# EAGLE board 1379_control (EAGLE 9.6.2)
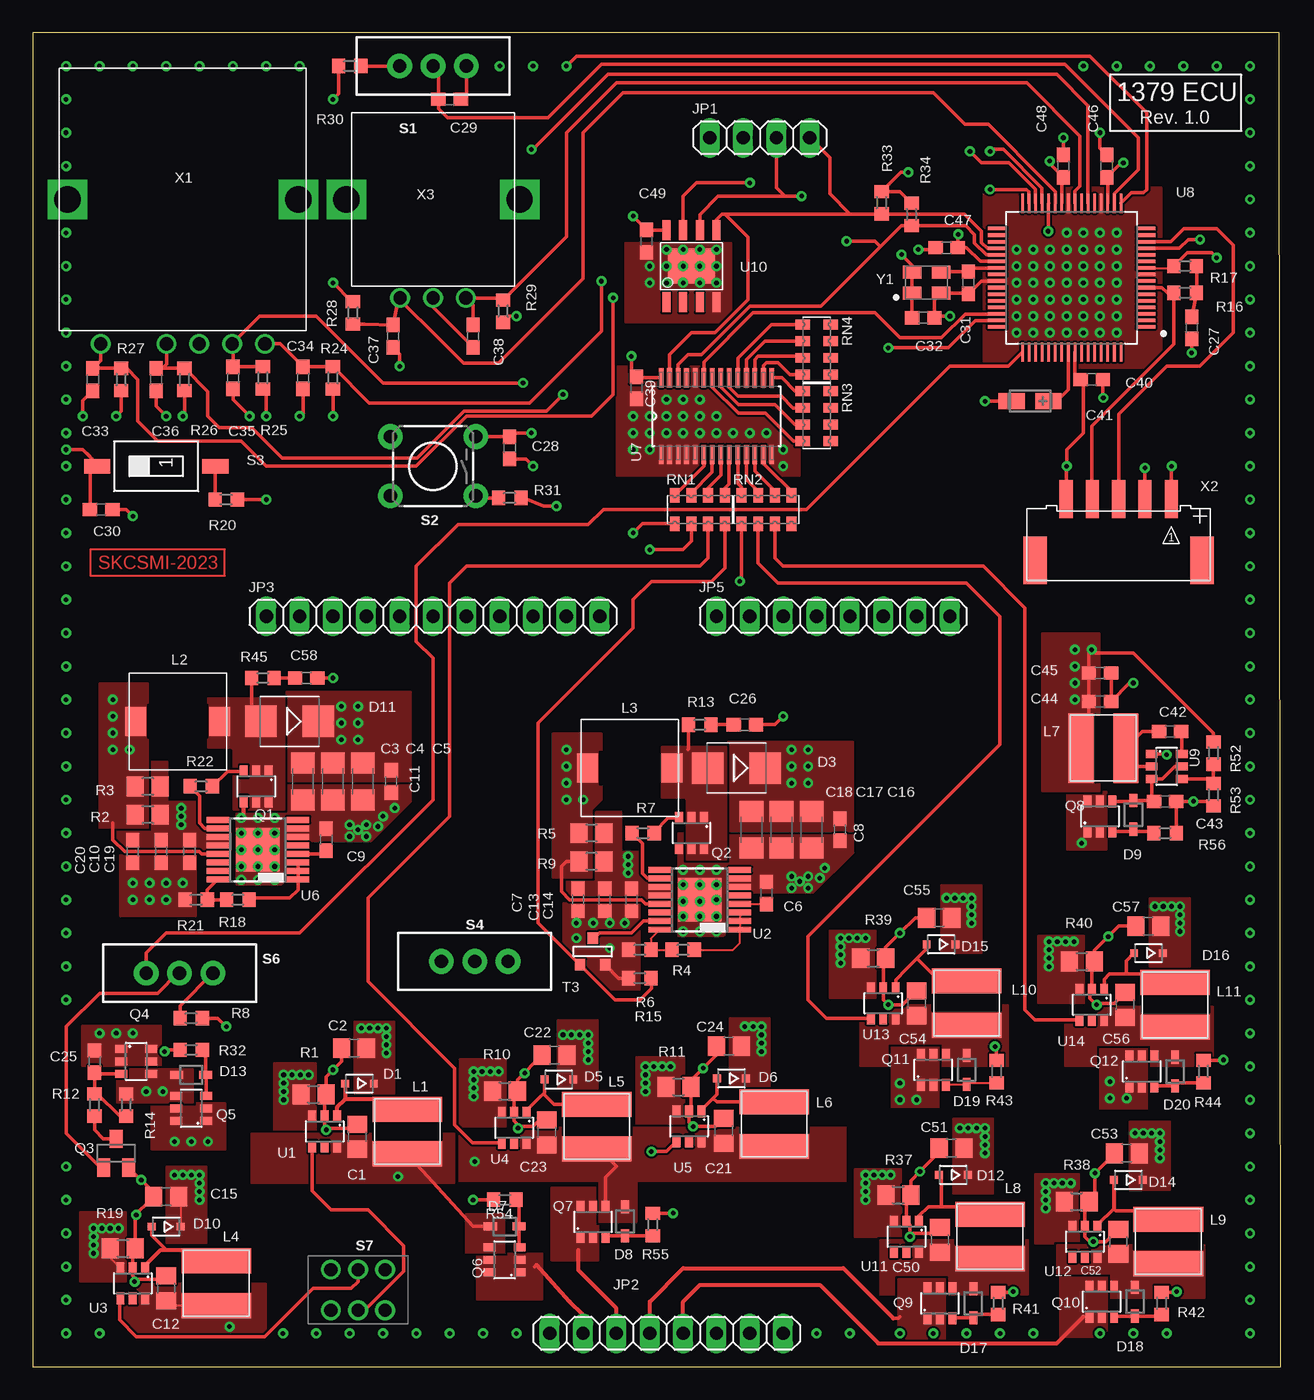
[diagram p10: board, top side]
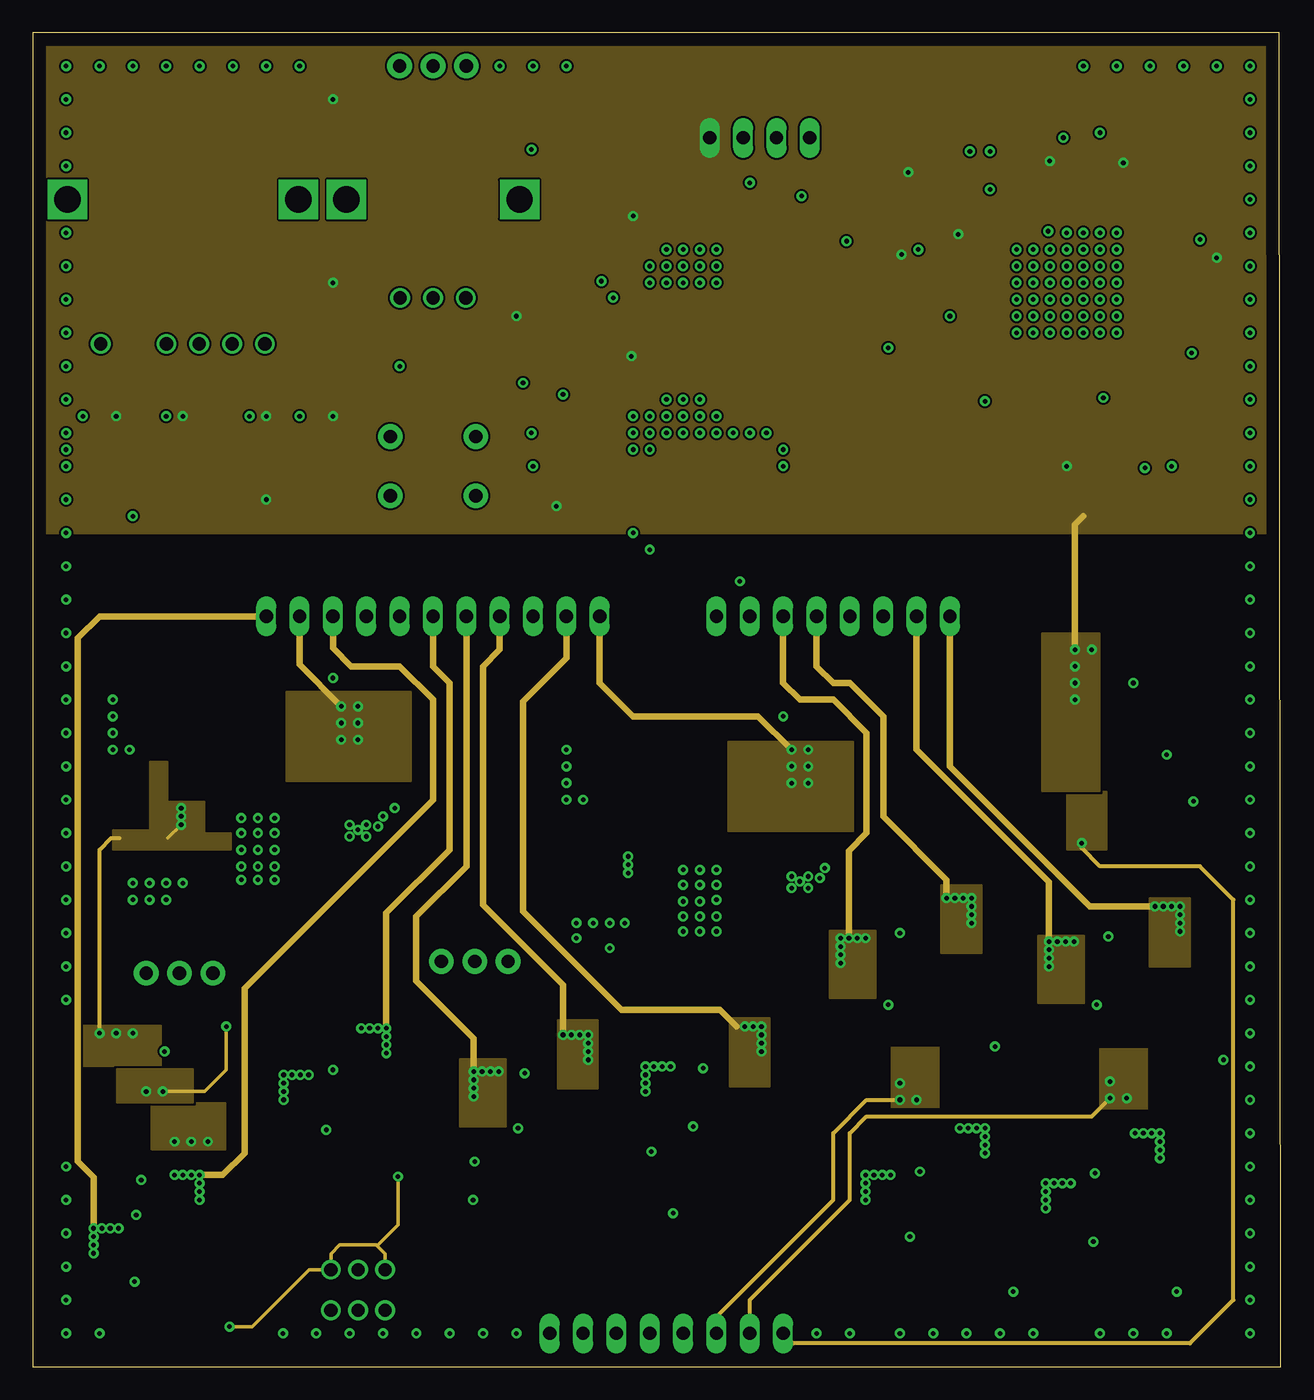
[diagram p11: board, inner layer Route2]
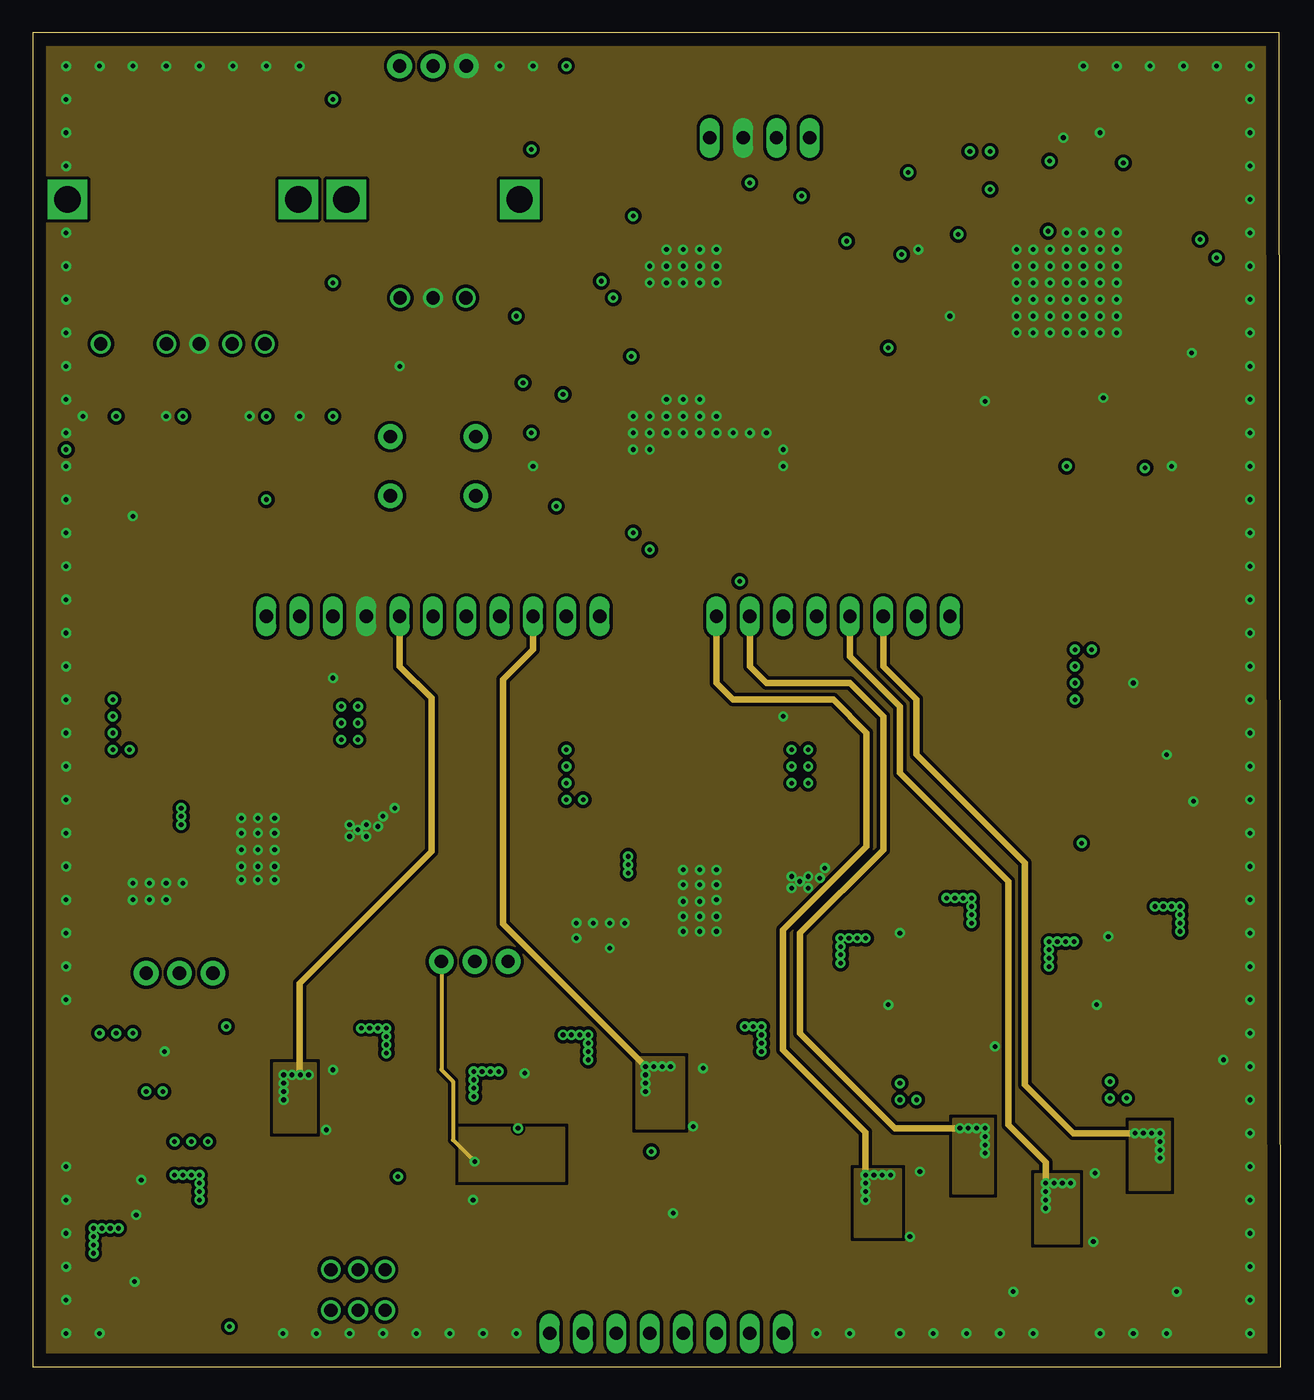
[diagram p12: board, inner layer Route15]
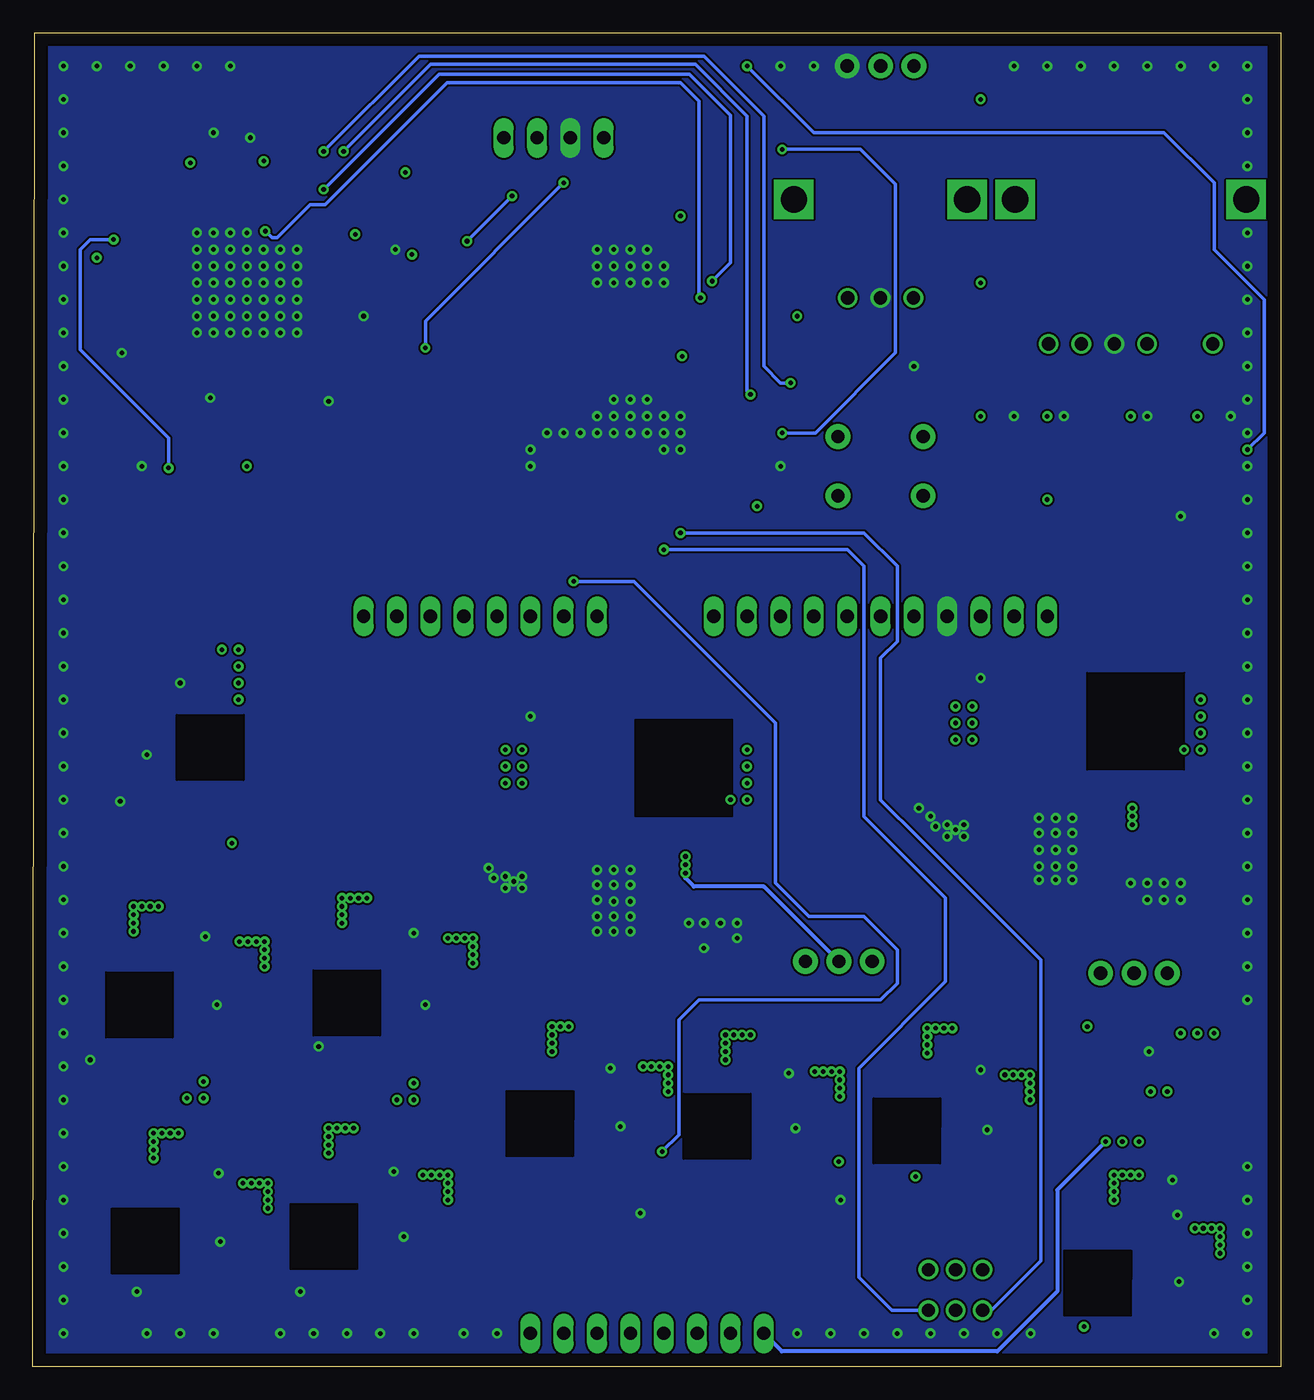
[diagram p13: board, bottom side, seen from below]

Size 95.05 x 101.59 mm. Coordinates in mm from the lower left corner, seen from the top.
Outline: 0,0 95.05,0 94.92,101.59 0,101.59 0,0
Copper layers (1+2*15+16): Top 0.035mm / dielectric 0.2mm / Route2 0.035mm / dielectric 1.065mm / Route15 0.035mm / dielectric 0.2mm / Bottom 0.035mm
Design rules "default *": minimum track width 6mil, minimum drill 0.35mm, track to track 6mil, track to pad 6mil, pad to pad 6mil, via to via 6mil, smd to smd 6mil, copper to edge 40mil, drill to drill 6mil, minimum pad ring 10mil, minimum via ring 8mil, stop-mask expansion 4mil, vias tented up to drill 0mil, thermal gap 10mil
tRestrict: 44 lines
bRestrict: 54 lines

## Footprints (pad centres in the part's own frame; a part is rotated, then mirrored left to right if it is on the bottom)
C0805 = smd 1.3 x 1.5: 1 -0.95,0; 2 0.95,0
C1206 = smd 1.6 x 1.8: 1 -1.4,0; 2 1.4,0
C0603 = smd 1.1 x 1: 1 -0.85,0; 2 0.85,0
CT3216 = smd 2 x 1.2: + -1.4,0; - 1.4,0
SOD323-R = smd 0.6 x 0.6: A 1.1,0; C -1.1,0
SMB = smd 2.4 x 2.4: A 2.2,0; C -2.2,0
SOD323 = smd 1 x 0.6: A 1.1,0; C -1.1,0
1X04 = drill 1.016 long: 1 -3.81,0; 2 -1.27,0; 3 1.27,0; 4 3.81,0
1X08 = drill 1.016 long: 1 -8.89,0; 2 -6.35,0; 3 -3.81,0; 4 -1.27,0; 5 1.27,0; 6 3.81,0; 7 6.35,0; 8 8.89,0
1X11 = drill 1.016 long: 1 -12.7,0; 2 -10.16,0; 3 -7.62,0; 4 -5.08,0; 5 -2.54,0; 6 0,0; 7 2.54,0; 8 5.08,0; 9 7.62,0; 10 10.16,0; 11 12.7,0
L_5X5 = smd 5.3 x 1.9: 1 0,-1.7; 2 0,1.7
L_7.4X7.4 = smd 2.2 x 1.6: 1 0,-3.2; 2 0,3.2
SOT23-6 = smd 0.6 x 0.9: 1 -0.95,-1.15; 2 0,-1.15; 3 0.95,-1.15; 4 0.95,1.15; 5 0,1.15; 6 -0.95,1.15
SOT23 = smd 1 x 1.4: 1 -0.95,-1.1; 2 0.95,-1.1; 3 0,1.1
R0805 = smd 1.3 x 1.5: 1 -0.95,0; 2 0.95,0
R0603 = smd 1 x 1.1: 1 -0.85,0; 2 0.85,0
EXBS8V = smd 0.75 x 1.1: 1 -1.905,-1.07; 2 -0.635,-1.07; 3 0.635,-1.07; 4 1.905,-1.07; 5 1.905,1.07; 6 0.635,1.07; 7 -0.635,1.07; 8 -1.905,1.07
SWITCH_SPDT_PTH_11.6X4.0MM = drill 1.016 pad 1.88: 1 0,2.54; 2 0,0; 3 0,-2.54
TACTILE_SWITCH_PTH_6.0MM = drill 1.016 pad 1.88: 1 -3.251,2.261; 2 3.251,2.261; 3 -3.251,-2.261; 4 3.251,-2.261
SMS-001 = smd 1.092 x 2.007: 1 0,-4.496; 2 0,4.496
SWITCH_DPDT_PTH_GPI-152-3013 = drill 1: 10 -2.06,1.55; 11 -2.06,-1.55; 20 2.06,1.55; 21 2.06,-1.55; C@1 0,1.55; C@2 0,-1.55
SOT-23 = smd 0.787 x 0.889: 1 0.025,-1.016; 2 -0.94,1.016; 3 0.991,1.016
TSSOP16E = smd 0.45 x 1.7: 1 -2.275,-3.05; 2 -1.625,-3.05; 3 -0.975,-3.05; 4 -0.325,-3.05; 5 0.325,-3.05; 6 0.975,-3.05; 7 1.625,-3.05; 8 2.275,-3.05; 9 2.275,3.05; 10 1.625,3.05; 11 0.975,3.05; 12 0.325,3.05; 13 -0.325,3.05; 14 -0.975,3.05; 15 -1.625,3.05; 16 -2.275,3.05 | smd 3.29 x 3.29: EXP 0,0
SOP65P640X110-28N = smd 1.473 x 0.356: 1 -2.921,4.216; 2 -2.921,3.581; 3 -2.921,2.921; 4 -2.921,2.286; 5 -2.921,1.626; 6 -2.921,0.965; 7 -2.921,0.33; 8 -2.921,-0.33; 9 -2.921,-0.965; 10 -2.921,-1.626; 11 -2.921,-2.286; 12 -2.921,-2.921; 13 -2.921,-3.581; 14 -2.921,-4.216; 15 2.921,-4.216; 16 2.921,-3.581; 17 2.921,-2.921; 18 2.921,-2.286; 19 2.921,-1.626; 20 2.921,-0.965; 21 2.921,-0.33; 22 2.921,0.33; 23 2.921,0.965; 24 2.921,1.626; 25 2.921,2.286; 26 2.921,2.921; 27 2.921,3.581; 28 2.921,4.216
PIC32MX-TQFN = smd 1.47 x 0.28: 1 -5.67,3.75; 2 -5.67,3.25; 3 -5.67,2.75; 4 -5.67,2.25; 5 -5.67,1.75; 6 -5.67,1.25; 7 -5.67,0.75; 8 -5.67,0.25; 9 -5.67,-0.25; 10 -5.67,-0.75; 11 -5.67,-1.25; 12 -5.67,-1.75; 13 -5.67,-2.25; 14 -5.67,-2.75; 15 -5.67,-3.25; 16 -5.67,-3.75; 33 5.67,-3.75; 34 5.67,-3.25; 35 5.67,-2.75; 36 5.67,-2.25; 37 5.67,-1.75; 38 5.67,-1.25; 39 5.67,-0.75; 40 5.67,-0.25; 41 5.67,0.25; 42 5.67,0.75; 43 5.67,1.25; 44 5.67,1.75; 45 5.67,2.25; 46 5.67,2.75; 47 5.67,3.25; 48 5.67,3.75 | smd 0.28 x 1.47: 17 -3.75,-5.67; 18 -3.25,-5.67; 19 -2.75,-5.67; 20 -2.25,-5.67; 21 -1.75,-5.67; 22 -1.25,-5.67; 23 -0.75,-5.67; 24 -0.25,-5.67; 25 0.25,-5.67; 26 0.75,-5.677; 27 1.25,-5.67; 28 1.75,-5.67; 29 2.25,-5.67; 30 2.75,-5.67; 31 3.25,-5.67; 32 3.75,-5.67; 49 3.75,5.67; 50 3.25,5.67; 51 2.75,5.67; 52 2.25,5.67; 53 1.75,5.67; 54 1.25,5.67; 55 0.75,5.67; 56 0.25,5.67; 57 -0.25,5.67; 58 -0.75,5.67; 59 -1.25,5.67; 60 -1.75,5.67; 61 -2.25,5.67; 62 -2.75,5.67; 63 -3.25,5.67; 64 -3.75,5.67
SO-8 = smd 1.524 x 0.61: 1 -2.743,1.905; 2 -2.743,0.635; 3 -2.743,-0.635; 4 -2.743,-1.905; 5 2.743,-1.905; 6 2.743,-0.635; 7 2.743,0.635; 8 2.743,1.905 | smd 2.7 x 3.6: EP 0,0
ENCODER = drill 1: P$1 -6.25,-11; P$2 -1.25,-11; P$3 1.25,-11; P$4 3.75,-11; P$5 6.25,-11 | drill 2 square: P$6 -8.8,0; P$7 8.8,0
BM05B-PASS = smd 1.8 x 3.6: A 0.15,-3.35; B -12.55,-3.35 | smd 1 x 2.9: P$1 -2.2,1.3; P$2 -4.2,1.3; P$3 -6.2,1.3; P$4 -8.2,1.3; P$5 -10.2,1.3
ENCODER-2 = drill 1: P$1 -2.5,-7.5; P$2 0,-7.5; P$3 2.5,-7.5 | drill 2 square: P$6 -6.6,0; P$7 6.6,0
WE-SPXO_CFPS-104 = smd 1.4 x 1: 1 -1.1,-0.8; 2 1.1,-0.8; 3 1.1,0.8; 4 -1.1,0.8

## Placement (x,y rotation side)
C1  10u  [C0805]  24.71,17.52 90 top
C2  1u  [C0805]  24.45,24.25 180 top
C3  1u  [C1206]  20.57,44.58 90 top
C4  1u  [C1206]  22.86,44.58 90 top
C5  1u  [C1206]  25.15,44.58 90 top
C6  100p  [C0603]  55.88,36.07 270 top
C7  4u7  [C0603]  41.53,35.56 90 top
C8  4u7  [C0603]  61.47,40.89 90 top
C9  100p  [C0603]  22.35,40.13 270 top
C10  4u7  [C0603]  9.78,39.24 90 top
C11  4u7  [C0603]  27.3,44.58 90 top
C12  10u  [C0805]  10.16,5.97 90 top
C13  1u  [C0603]  43.56,35.56 90 top
C14  100n  [C0603]  45.59,35.56 90 top
C15  1u  [C0805]  10.16,12.95 180 top
C16  1u  [C1206]  59.31,40.89 90 top
C17  1u  [C1206]  57.02,40.89 90 top
C18  1u  [C1206]  54.74,40.89 90 top
C19  100n  [C0603]  11.94,39.24 90 top
C20  1u  [C0603]  7.62,39.24 90 top
C21  10u  [C0805]  52.62,17.95 90 top
C22  1u  [C0805]  39.74,23.73 180 top
C23  10u  [C0805]  39.14,17.84 90 top
C24  1u  [C0805]  53.02,24.41 180 top
C25  100n  [C0603]  4.7,23.24 270 top
C26  10p  [C0603]  54.23,48.89 180 top
C27  100nF  [C0603]  88.27,79.12 270 top
C28  100nF  [C0603]  36.32,69.98 270 top
C29  100nF  [C0603]  31.75,96.52 0 top
C30  100nF  [C0603]  5.21,65.28 0 top
C31  15pF  [C0603]  71.25,82.55 270 top
C32  100nF  [C0603]  67.82,79.88 0 top
C33  100nF  [C0603]  4.57,75.18 270 top
C34  100nF  [C0603]  20.57,75.31 270 top
C35  100nF  [C0603]  15.24,75.31 270 top
C36  100nF  [C0603]  9.4,75.18 270 top
C37  100nF  [C0603]  27.43,78.49 270 top
C38  100nF  [C0603]  33.53,78.49 270 top
C39  100nF  [C0603]  45.97,74.55 270 top
C40  100nF  [C0603]  80.64,75.18 0 top
C41  10uF/6.3V  [CT3216]  75.95,73.53 180 top
C42  100nF  [C0603]  86.61,48.39 180 top
C43  100nF  [C0603]  86.23,43.05 180 top
C44  22u  [C0603]  81.28,50.67 180 top
C45  22u  [C0603]  81.28,52.83 180 top
C46  100nF  [C0603]  81.79,91.44 90 top
C47  100nF  [C0603]  69.6,85.22 180 top
C48  100nF  [C0603]  78.49,91.44 90 top
C49  100nF  [C0603]  46.74,85.73 270 top
C50  10u  [C0805]  69.09,9.65 90 top
C51  1u  [C0805]  69.98,16.64 180 top
C52  10u  [C0805]  82.68,9.53 90 top
C53  1u  [C0805]  83.31,16.26 180 top
C54  10u  [C0805]  67.31,27.69 90 top
C55  1u  [C0805]  69.03,34.19 180 top
C56  10u  [C0805]  83.19,27.56 90 top
C57  1u  [C0805]  84.95,33.55 180 top
C58  10p  [C0603]  20.83,52.45 180 top
D1  PMEG6002EJ115  [SOD323-R]  24.88,21.56 180 top
D3  B2100  [SMB]  53.59,45.59 180 top
D5  PMEG6002EJ115  [SOD323-R]  40.06,21.87 180 top
D6  PMEG6002EJ115  [SOD323-R]  53.21,21.96 180 top
D7  BZX84J  [SOD323]  35.95,10.68 0 top
D8  BZX84J  [SOD323]  45.11,11.08 270 top
D9  BZX84J  [SOD323]  83.82,42.04 270 top
D10  PMEG6002EJ115  [SOD323-R]  10.16,10.67 180 top
D11  B2100  [SMB]  19.56,49.15 180 top
D12  PMEG6002EJ115  [SOD323-R]  70.1,14.61 180 top
D13  BZX84J  [SOD323]  12.07,22.23 0 top
D14  PMEG6002EJ115  [SOD323-R]  83.44,14.22 180 top
D15  PMEG6002EJ115  [SOD323-R]  69.18,32.17 180 top
D16  PMEG6002EJ115  [SOD323-R]  84.97,31.5 180 top
D17  BZX84J  [SOD323]  71.63,4.83 270 top
D18  BZX84J  [SOD323]  83.95,4.95 270 top
D19  BZX84J  [SOD323]  71.12,22.61 270 top
D20  BZX84J  [SOD323]  87,22.48 270 top
JP1  [1X04]  55.37,93.6 0 top
JP2  [1X08]  48.26,2.54 0 top
JP3  [1X11]  30.48,57.15 0 top
JP5  [1X08]  60.96,57.15 0 top
L1  SRR4828A-101M  [L_5X5]  28.52,17.9 0 top
L2  7447773101  [L_7.4X7.4]  11.05,49.15 270 top
L3  470u  [L_7.4X7.4]  45.47,45.59 270 top
L4  SRR4828A-101M  [L_5X5]  13.97,6.35 0 top
L5  SRR4828A-101M  [L_5X5]  42.95,18.28 0 top
L6  SRR4828A-101M  [L_5X5]  56.48,18.46 0 top
L7  LPS5030-103MRC  [L_5X5]  81.53,47.12 90 top
L8  SRR4828A-101M  [L_5X5]  72.9,9.91 0 top
L9  SRR4828A-101M  [L_5X5]  86.49,9.53 0 top
L10  SRR4828A-101M  [L_5X5]  71.12,27.69 0 top
L11  SRR4828A-101M  [L_5X5]  87,27.56 0 top
Q1  ZXMN6A08E6  [SOT23-6]  17.02,44.2 180 top
Q2  ZXMN6A08E6  [SOT23-6]  50.16,40.64 180 top
Q3  IRLML0100TR  [SOT23]  6.35,16.26 0 top
Q4  ZXMP3A17E6  [SOT23-6]  7.87,23.24 270 top
Q5  ZXMP3A17E6  [SOT23-6]  12.07,19.68 90 top
Q6  ZXMP3A17E6  [SOT23-6]  35.95,8.14 90 top
Q7  ZXMP3A17E6  [SOT23-6]  42.67,11.03 0 top
Q8  ZXMP3A17E6  [SOT23-6]  81.28,41.91 0 top
Q9  ZXMP3A17E6  [SOT23-6]  69.09,4.83 0 top
Q10  ZXMP3A17E6  [SOT23-6]  81.41,4.95 0 top
Q11  ZXMP3A17E6  [SOT23-6]  68.58,22.61 0 top
Q12  ZXMP3A17E6  [SOT23-6]  84.45,22.48 0 top
R1  1R3  [R0805]  21.38,20.75 0 top
R2  0R56  [R0805]  8.76,42.04 180 top
R3  0R56  [R0805]  8.76,44.2 180 top
R4  68k  [R0603]  49.53,31.75 180 top
R5  2R2  [R0805]  42.55,40.64 180 top
R6  22k  [R0603]  46.23,31.75 180 top
R7  2R2  [R0603]  46.48,40.64 0 top
R8  10k  [R0603]  12.07,26.54 0 top
R9  2R2  [R0805]  42.55,38.48 180 top
R10  4R  [R0805]  35.95,20.99 0 top
R11  4R  [R0805]  49.17,21.32 0 top
R12  0R  [R0603]  4.7,19.94 90 top
R13  1k  [R0603]  50.8,48.89 180 top
R14  10k  [R0603]  7.11,19.94 90 top
R15  10k  [R0603]  46.23,29.59 0 top
R16  1k  [R0603]  87.76,81.79 180 top
R17  10k  [R0603]  87.76,83.82 0 top
R18  110k  [R0603]  15.62,35.56 180 top
R19  1R3  [R0805]  6.86,9.02 0 top
R20  10k  [R0603]  14.73,66.04 180 top
R21  39k  [R0603]  12.45,35.56 180 top
R22  2R2  [R0603]  12.83,44.2 0 top
R24  10k  [R0603]  22.86,75.31 90 top
R25  10k  [R0603]  17.53,75.31 90 top
R26  10k  [R0603]  11.56,75.18 90 top
R27  10k  [R0603]  6.73,75.18 90 top
R28  10k  [R0603]  24.38,80.26 270 top
R29  10k  [R0603]  35.81,80.39 90 top
R30  10k  [R0603]  24.13,99.06 0 top
R31  10k  [R0603]  36.32,66.17 180 top
R32  10k  [R0603]  12.07,24.13 180 top
R33  4k7  [R0603]  64.64,88.65 270 top
R34  4k7  [R0603]  66.93,87.76 270 top
R37  1R05  [R0805]  65.91,13.08 0 top
R38  1R43  [R0805]  79.5,12.57 0 top
R39  6R6  [R0805]  64,31.12 0 top
R40  2R2  [R0805]  79.91,30.86 0 top
R41  10k  [R0603]  73.53,4.83 90 top
R42  10k  [R0603]  85.98,4.83 90 top
R43  10k  [R0603]  73.41,22.48 90 top
R44  10k  [R0603]  89.15,22.48 90 top
R45  1k  [R0603]  17.53,52.45 180 top
R52  100k  [R0603]  89.92,46.74 270 top
R53  22k1  [R0603]  89.92,43.56 270 top
R54  10k  [R0603]  35.95,12.71 180 top
R55  10k  [R0603]  47.21,10.83 90 top
R56  10k  [R0603]  86.23,40.64 0 top
RN1  [EXBS8V]  50.8,65.28 0 top
RN2  [EXBS8V]  55.88,65.28 0 top
RN3  [EXBS8V]  59.69,72.39 270 top
RN4  [EXBS8V]  59.69,77.47 270 top
S1  [SWITCH_SPDT_PTH_11.6X4.0MM]  30.48,99.06 90 top
S2  MOMENTARY-SWITCH-SPST-PTH-6.0MM  [TACTILE_SWITCH_PTH_6.0MM]  30.48,68.58 180 top
S3  SWS001  [SMS-001]  9.4,68.58 90 top
S4  [SWITCH_SPDT_PTH_11.6X4.0MM]  33.66,30.86 270 top
S6  [SWITCH_SPDT_PTH_11.6X4.0MM]  11.18,29.97 90 top
S7  DPDT  [SWITCH_DPDT_PTH_GPI-152-3013]  24.77,5.84 0 top
T3  2N7002A  [SOT-23]  42.67,31.62 180 top
U1  AP3031  [SOT23-6]  22.23,17.91 180 top
U2  ZXLD1370Q  [TSSOP16E]  50.8,35.56 90 top
U3  AP3031  [SOT23-6]  7.62,6.35 180 top
U4  AP3031  [SOT23-6]  36.67,18.2 180 top
U5  AP3031  [SOT23-6]  49.99,18.31 180 top
U6  ZXLD1370Q  [TSSOP16E]  17.14,39.37 90 top
U7  PCA9685PW,118  [SOP65P640X110-28N]  52.07,72.39 90 top
U8  PIC32MX120F064H  [PIC32MX-TQFN]  79.12,82.93 180 top
U9  LMR51420  [SOT23-6]  86.36,45.72 270 top
U10  ST-M24256E-FMN6TP  [SO-8]  50.16,83.82 90 top
U11  AP3031  [SOT23-6]  66.55,9.91 180 top
U12  AP3031  [SOT23-6]  80.14,9.53 180 top
U13  AP3031  [SOT23-6]  64.77,27.69 180 top
U14  AP3031  [SOT23-6]  80.64,27.56 180 top
X1  ENODER_ROTARY  [ENCODER]  11.43,88.9 0 top
X2  BM05B-PASS  [BM05B-PASS]  88.9,64.77 0 top
X3  ENCODER-2  [ENCODER-2]  30.48,88.9 0 top
Y1  MCSJK-3N-8.00-3.3-25-B  [WE-SPXO_CFPS-104]  68.07,82.55 0 top

## Tracks (layer width: path | path; a pad name or v marks a point on that pad's centre or on a via)
3,3V  (via drill 0.35)
  Top 0.152: U8.10 86.77,83.68 R17.1
  Top 0.254: U8.57 79.37,75.61 C40.1 80.01,74.97 80.01,72.39 80.01,71.12 78.74,69.85 v78.74,68.58 78.7,68.54 X2.P$5 | R17.1 87.92,84.84 89.79,84.84 v90.17,84.45 | U8.38 72.16,84.18 71.12,85.22 C47.1 | U8.19 81.87,90.51 C46.1 82.89,91.69 v83.06,91.69 | U8.26 78.37,90.49 78.36,90.5 78.4,90.5 C48.1 77.47,91.61 v77.47,91.82 v77.45,91.82 | U7.28 46.06,75.31 C39.1 45.59,75.78 v45.59,76.96 | R34.1 66.04,89.5 R33.1 66.11,90.96 v66.67,90.96 | L7.2 80.43,47.71 C44.2 C45.2 80.43,54.39 v80.64,54.61 80.9,54.36 83.82,54.36 89.92,48.26 R52.1 | C49.1 48.25,86.58 U10.8 | C49.1 46.99,86.83 | C32.1 Y1.1 Y1.4 66.97,83.9 v66.17,84.71 | C47.1 70.45,86.36 | C47.1 70.45,86.21 v70.48,86.25 | C49.1 46.74,86.61 v45.72,87.63 | R31.1 37.41,66.17 38.9,65.53 v39.88,65.53 | v17.78,66.04 R20.1 | R30.1 23.28,96.94 v22.86,96.52 | R27.1 6.73,72.77 v6.35,72.39 | R26.1 11.56,72.52 v11.43,72.39 | R25.1 17.78,74.21 v17.78,72.39 | R24.1 v22.86,72.39 | R28.1 24.3,81.11 v22.86,82.55 | R29.1 36.28,80.01 v36.83,80.01
  Route2 0.254: 66.67,91 66.64,91.03 66.64,91 v66.67,90.96 66.67,90.9 66.71,90.9
  Route2 0.508: v79.38,54.61 79.38,64.14 80.01,64.77
  other vias: 79.38,53.34 79.38,52.07 79.38,50.8
  pour Top (no thermals): 81.28,55.88 81.28,43.81 76.83,43.81 76.83,55.88
  pour Route2 (no thermals): 81.28,55.88 81.28,43.81 76.83,43.81 76.83,55.88
  pour Route2 (no thermals): -2.54,102.87 -2.54,63.5 96.52,63.5 96.52,102.87
!MCLR
  Top 0.254: U8.7 86.01,82.18 86.4,81.79 R16.2 86.91,77.89 80.64,71.63 80.64,66.12 X2.P$4
!WC  (via drill 0.35)
  Top 0.254: U10.7 49.53,89.15 50.55,90.17 v54.61,90.17 | U8.47 71.81,79.68 69.72,77.6 v65.15,77.6
  Bottom 0.254: v65.15,77.6 65.15,79.63 v54.61,90.17
CHMSL  (via drill 0.35)
  Route2 0.305: JP2.7 54.61,5.08 62.23,12.7 62.23,17.78 63.5,19.05 80.64,19.05 v82.04,20.45
  other vias: 83.31,20.45 82.04,21.72
  pour Top (no thermals): 84.85,24.21 84.85,19.62 81.3,19.62 81.3,24.21
  pour Route2 (no thermals): 84.85,24.21 84.85,19.62 81.3,19.62 81.3,24.21
CHMSL_A  (via drill 0.35)
  Route2 0.508: JP5.8 69.85,45.72 80.52,35.05 v85.47,35.05
  other vias: 86.11,35.05 86.74,35.05 87.38,34.42 87.38,33.78 87.38,33.15 87.38,35.05
  pour Top (rank 3, no thermals): 85.05,35.69 85.05,30.44 88.15,30.44 88.15,35.69
  pour Route2 (rank 3, no thermals): 85.05,35.69 85.05,30.44 88.15,30.44 88.15,35.69
CHMSL_K  (via drill 0.35)
  Route2 0.508: v77.4,31.75 77.4,36.9 67.31,46.99 JP5.7
  other vias: 78.03,32.38 78.67,32.38 79.3,32.38 77.4,32.38 77.4,31.11 77.4,30.48
  pour Top (rank 3, no thermals): 76.55,27.65 80.11,27.65 80.11,32.86 76.55,32.86
  pour Route2 (rank 3, no thermals): 76.55,27.65 80.11,27.65 80.11,32.86 76.55,32.86
CLOCK
  Top 0.254: U8.39 71.53,83.68 C31.1 69.22,83.4 Y1.3
CTRL1
  Top 0.254: U3.4 6.6,5.13 6.6,3.56 7.87,2.29 17.65,2.29 21.34,5.97 24.26,5.97 24.77,6.48 S7.C@1
CTRL2
  Top 0.254: S7.C@2 25.27,4.29 28.24,7.26 28.24,9.22 25.53,11.94 22.73,11.94 21.28,13.39 U1.4
FOG
  Top 0.254: 65.53,3.68 65.91,3.68 66.04,3.81
  Top 0.305: JP2.4 46.99,4.95 49.53,7.49 61.72,7.49 65.53,3.68
  pour Top (no thermals): 69.48,6.68 69.48,2.1 65.93,2.1 65.93,6.68
FOG_A  (via drill 0.35)
  Route15 0.508: JP5.2 54.61,53.34 55.88,52.07 62.23,52.07 64.77,49.53 64.77,39.37 58.42,33.02 58.42,25.4 65.66,18.16 v70.61,18.16
  other vias: 71.25,18.16 71.88,18.16 72.52,17.53 72.52,16.89 72.52,16.26 72.52,18.16
  pour Top (rank 3, no thermals): 70.06,18.93 70.06,13.17 73.16,13.17 73.16,18.93
  pour Route15 (rank 2, no thermals): 70.06,18.93 70.06,13.17 73.16,13.17 73.16,18.93
FOG_K  (via drill 0.35)
  Route15 0.508: v63.43,13.97 63.43,17.85 57.15,24.13 57.15,33.27 63.5,39.62 63.5,48.26 60.96,50.8 53.34,50.8 52.07,52.07 JP5.1
  other vias: 64.06,14.6 64.7,14.6 65.33,14.6 63.43,14.6 63.43,13.33 63.43,12.7
  pour Top (rank 3, no thermals): 62.59,9.87 66.14,9.87 66.14,15.08 62.59,15.08
  pour Route15 (rank 2, no thermals): 62.59,9.87 66.14,9.87 66.14,15.08 62.59,15.08
FREQ/DUTY
  Top 0.254: S1.2 30.9,98.64 C29.1 30.9,95.81 31.59,95.12 39.24,95.12 43.31,99.19 78.61,99.19 84.2,93.6 84.2,91.18 82.37,89.35 U8.18
GND  (via drill 0.35)
  Top 0.152: C32.2 68.67,80.01 | C47.2 68.62,85.09
  Top 0.254: C12.2 9.88,6.64 7.91,6.64 | 7.91,6.64 7.62,6.93 U3.2 7.62,8.83 R19.2 7.81,11.55 8.92,12.67 | 8.92,12.67 C15.2 | C1.2 24.4,18.16 22.48,18.16 22.35,18.29 | 22.35,18.29 22.23,18.41 U1.2 22.23,20.65 R1.2 22.33,22.07 23.51,23.25 C2.2 | C23.2 38.61,18.8 38.1,18.29 37.08,18.29 | 37.08,18.29 36.67,18.71 U4.2 36.67,20.76 R10.2 36.9,21.85 C22.2 | Q3.2 8.92,13.53 8.92,12.67 | v7.75,6.48 7.91,6.64 | v10.03,24 10.16,24.13 R32.2 | v22.35,18.03 22.35,18.29 | R54.2 33.54,12.71 v33.53,12.7 | v36.96,18.16 37.08,18.29 | R55.2 v48.76,11.68 v48.77,11.68 | C24.2 52.07,23.75 v51.05,22.73 50.12,21.8 R11.2 50.12,19.59 U5.2 49.99,18.59 v50.29,18.29 52.01,18.29 C21.2 | R15.1 44.63,29.59 T3.2 | C58.1 v22.86,52.45 22.99,52.45 | C50.2 68.65,10.16 67.06,10.16 v66.8,9.91 66.8,10.8 U11.2 66.55,12.77 R37.2 66.86,14.16 v67.56,14.86 69.03,16.32 C51.2 | R42.2 87.08,5.68 v87.12,5.71 | R41.2 74.64,5.68 v74.68,5.71 | C52.2 81.73,9.53 v80.77,9.53 80.52,9.53 80.14,9.91 U12.2 80.14,12.26 R38.2 80.9,13.02 v80.9,14.73 82.36,16.2 C53.2 | R43.2 73.41,24.26 v73.28,24.38 | R44.2 90.64,23.33 v90.68,23.37 | C57.2 82.7,33.55 v81.91,32.77 80.86,31.71 R40.2 80.64,30.65 U14.2 80.52,28.58 80.52,28.07 v81.03,27.56 81.15,27.69 82.36,27.69 C56.2 | C55.2 67.21,34.19 v66.04,33.02 64.95,31.93 R39.2 64.77,30.93 U13.2 64.77,27.94 v65.15,27.56 66.23,27.56 C54.2 | U9.1 86.3,46.67 v86.36,46.61 | C45.1 C44.1 83.53,52.07 v83.82,52.07 | R53.2 89.57,43.05 v88.39,43.05 C43.1 R56.2 | X2.P$1 86.7,68.54 v86.74,68.58 | v81.28,93.98 81.28,92.8 C46.2 | C48.2 v78.49,93.6 78.49,93.73 | C27.2 v88.27,77.22 88.27,77.09 | C40.2 81.5,73.83 v81.53,73.79 | C41.- v72.52,73.53
  Top 0.254: 4.45,74.21 C33.2 3.81,73.57 v3.81,72.39 | U8.41 72.23,82.68 C31.2 71.2,81.75 Y1.2 68.67,81.25 68.67,80.01 v69.85,80.01 | 68.62,85.09 v67.44,85.09 67.31,85.09 | 15.09,74.31 C35.2 15.24,73.66 v16.51,72.39 | C28.2 37.55,69.13 v38.1,68.58 | S1.3 33.02,96.94 C29.2 | C26.1 56.52,48.89 v57.15,49.53 | C36.2 9.4,73.15 v10.16,72.39 | C34.2 20.57,72.64 v20.32,72.39 | C37.2 27.94,77.13 v27.94,76.2 | C38.2 30.48,80.68 X3.P$2 | C30.2 7.11,65.28 v7.62,64.77
  Top 0.305: v15.88,41.78 16,41.91 16,42.98 Q1.4
  other vias: 17.14,39.37 15.88,40.64 17.14,40.64 18.41,40.64 18.41,39.37 15.88,39.37 17.14,38.1 18.41,38.1 15.88,38.1 52.07,35.56 49.53,34.29 50.8,34.29 52.07,34.29 7.62,36.83 8.89,36.83 10.16,36.83 11.43,36.83 24.13,41.27 25.4,41.27 26.67,41.91 24.13,40.39 25.4,40.39 27.56,42.54 26.29,41.15 24.77,40.89 17.14,41.78 18.41,41.78 15.88,37.08 17.14,37.08 18.41,37.08 10.16,35.56 8.89,35.56 7.62,35.56 41.4,33.78 42.67,33.78 43.94,33.78 45.09,33.78 43.94,31.88 41.4,32.64 50.8,35.43 49.53,36.7 50.8,36.7 52.07,36.7 49.53,35.43 49.53,37.85 57.78,37.34 59.05,37.34 60.32,37.97 57.78,36.45 59.05,36.45 59.94,37.21 58.42,36.96 50.8,37.85 52.07,37.85 49.53,33.15 50.8,33.15 52.07,33.15 7.87,11.56 8.25,14.22 22.86,22.61 37.46,22.35 49.53,83.82 50.8,83.82 52.07,83.82 52.07,82.55 50.8,82.55 49.53,82.55 48.26,82.55 48.26,83.82 48.26,85.09 49.53,85.09 50.8,85.09 52.07,85.09 46.99,83.82 46.99,82.55 74.93,82.55 76.2,82.55 77.47,82.55 78.74,82.55 80.01,82.55 81.28,82.55 82.55,82.55 74.93,85.09 76.2,85.09 77.47,85.09 78.74,85.09 80.01,85.09 81.28,85.09 82.55,85.09 78.74,86.36 80.01,86.36 81.28,86.36 82.55,86.36 74.93,83.82 76.2,83.82 77.47,83.82 78.74,83.82 80.01,83.82 81.28,83.82 82.55,83.82 74.93,81.28 76.2,81.28 77.47,81.28 78.74,81.28 80.01,81.28 81.28,81.28 82.55,81.28 74.93,80.01 76.2,80.01 77.47,80.01 78.74,80.01 80.01,80.01 81.28,80.01 82.55,80.01 74.93,78.74 76.2,78.74 77.47,78.74 78.74,78.74 80.01,78.74 81.28,78.74 82.55,78.74 48.26,73.66 49.53,73.66 49.53,72.39 49.53,71.12 48.26,71.12 48.26,72.39 46.99,72.39 46.99,71.12 45.72,72.39 45.72,71.12 46.99,69.85 45.72,69.85 50.8,71.12 52.07,71.12 53.34,71.12 54.61,71.12 55.88,71.12 57.15,69.85 57.15,68.58 50.8,72.39 52.07,72.39 50.8,73.66 92.71,2.54 92.71,5.08 92.71,7.62 92.71,10.16 92.71,12.7 92.71,15.24 92.71,17.78 92.71,20.32 92.71,22.86 92.71,25.4 92.71,27.94 92.71,30.48 92.71,33.02 92.71,35.56 92.71,38.1 92.71,40.64 92.71,43.18 92.71,45.72 92.71,48.26 92.71,50.8 92.71,53.34 92.71,55.88 92.71,58.42 92.71,60.96 92.71,63.5 92.71,66.04 92.71,68.58 92.71,71.12 92.71,73.66 92.71,76.2 92.71,78.74 92.71,81.28 92.71,83.82 92.71,86.36 92.71,88.9 92.71,91.44 92.71,93.98 92.71,96.52 92.71,99.06 90.17,99.06 87.63,99.06 85.09,99.06 82.55,99.06 80.01,99.06 20.32,99.06 17.78,99.06 15.24,99.06 35.56,99.06 38.1,99.06 12.7,99.06 10.16,99.06 7.62,99.06 5.08,99.06 2.54,99.06 2.54,86.36 2.54,91.44 2.54,93.98 2.54,96.52 2.54,73.66 2.54,76.2 2.54,78.74 2.54,81.28 2.54,83.82 2.54,60.96 2.54,63.5 2.54,66.04 2.54,68.58 2.54,71.12 2.54,48.26 2.54,50.8 2.54,53.34 2.54,55.88 2.54,58.42 2.54,35.56 2.54,38.1 2.54,40.64 2.54,43.18 2.54,45.72 2.54,27.94 2.54,30.48 2.54,33.02 2.54,10.16 2.54,12.7 2.54,15.24 2.54,2.54 2.54,5.08 2.54,7.62 5.08,2.54 29.21,2.54 26.67,2.54 24.13,2.54 21.59,2.54 19.05,2.54 36.83,2.54 34.29,2.54 31.75,2.54 81.28,2.54 86.36,2.54 83.82,2.54 68.58,2.54 66.04,2.54 76.2,2.54 73.66,2.54 71.12,2.54 59.69,2.54 62.23,2.54
  pour Route15 (isolate 0.254, rank 4, no thermals): -3.81,105.41 -3.81,-2.54 96.52,-2.54 100.33,1.27 100.33,104.14 99.06,105.41
  pour Top (rank 3, no thermals): 15.49,44.58 15.49,36.7 18.92,36.7 19.05,36.83 19.05,40 25.78,40 28.83,43.05 28.83,44.58
  pour Top (rank 3, no thermals): 12.45,38.99 6.6,38.99 6.6,34.29 12.45,34.29
  pour Top (rank 3, no thermals): 46.23,35.31 40.39,35.31 40.39,28.7 46.23,28.7
  pour Top (rank 3, no thermals): 49.15,40.64 49.15,32.77 52.58,32.77 52.7,32.89 52.7,36.07 59.44,36.07 62.48,39.12 62.48,40.64
  pour Top (rank 3, no thermals): 45.21,85.6 53.21,85.6 53.21,79.63 53.09,79.5 45.09,79.5 45.09,85.6
  pour Top (rank 3, no thermals): 72.39,89.28 72.39,76.07 85.98,76.07 85.98,89.79 72.39,89.79
  pour Top (rank 3, no thermals): 58.42,76.2 58.42,67.82 44.45,67.82 44.45,76.2
  pour Bottom (no thermals): -3.81,105.41 -3.81,-2.54 96.52,-2.54 100.33,1.27 100.33,104.14 99.06,105.41
LET  (via drill 0.35)
  Route2 0.305: JP2.6 52.07,3.81 60.96,12.7 60.96,17.78 63.5,20.32 v66.04,20.32
  other vias: 66.04,21.59 67.31,20.32
  pour Top (no thermals): 68.98,24.33 68.98,19.75 65.42,19.75 65.42,24.33
  pour Route2 (no thermals): 68.98,24.33 68.98,19.75 65.42,19.75 65.42,24.33
LET_A  (via drill 0.35)
  Route2 0.508: v69.6,35.69 69.6,37.08 64.77,41.91 64.77,49.53 62.23,52.07 60.96,52.07 59.69,53.34 JP5.4
  other vias: 70.23,35.69 70.87,35.69 71.5,35.05 71.5,34.42 71.5,33.78 71.5,35.69
  pour Top (rank 3, no thermals): 69.17,36.71 69.17,31.46 72.27,31.46 72.27,36.71
  pour Route2 (rank 3, no thermals): 69.17,36.71 69.17,31.46 72.27,31.46 72.27,36.71
LET_K  (via drill 0.35)
  Route2 0.508: v62.16,32.64 62.16,39.3 63.5,40.64 63.5,48.26 60.96,50.8 58.42,50.8 57.15,52.07 JP5.3
  other vias: 62.79,32.64 63.43,32.64 61.52,32.64 61.52,32 61.52,31.37 61.52,30.73
  pour Top (rank 3, no thermals): 60.68,28.03 64.23,28.03 64.23,33.24 60.68,33.24
  pour Route2 (rank 3, no thermals): 60.68,28.03 64.23,28.03 64.23,33.24 60.68,33.24
LOCK  (via drill 0.35)
  Top 0.254: U8.17 83.68,89.41 84.58,89.41 84.84,89.66 84.84,91.44 84.84,92.58 | 84.84,92.84 84.84,92.58 | 84.84,92.58 84.84,95.5 80.52,99.82 41.4,99.82 v40.64,99.06 | C30.1 4.36,68.03 S3.2 4.9,68.76 3.81,69.85 | v2.54,69.85 3.81,69.85 | 3.81,69.85 4.32,69.34
  Bottom 0.254: v40.64,99.06 35.56,93.98 8.89,93.98 5.08,90.17 5.08,85.09 1.27,81.28 1.27,71.12 v2.54,69.85
N$1
  Top 0.305: U1.1 23.18,19.77 23.78,20.37 | 23.78,20.37 D1.A | L1.2 27.75,20.37 23.78,20.37
N$2
  Top 0.152: U2.4 55.86,35.23 C6.2
N$3  (via drill 0.35)
  Top 0.254: U2.13 46.68,35.23 46.35,35.56 40.89,35.56 40.26,36.2 40.26,38.1 40.64,38.48 R9.2
  other vias: 41.91,43.18 40.64,43.18 40.64,44.45 40.64,45.72 40.64,46.99
  pour Top (no thermals): 42.55,37.21 39.62,37.21 39.62,48.26 43.31,48.26 43.31,43.18 42.55,42.42
N$4
  Top 0.254: R13.2 49.95,47.03 49.91,46.99
  pour Top (no thermals): 49.78,38.61 52.83,38.61 52.83,47.24 47.88,47.24 47.88,43.31 49.66,43.31 49.78,43.18
N$5
  Top 0.152: R4.2 R6.1 47.08,32.61 U2.16
N$6
  Top 0.152: R4.1 53.34,31.75 53.85,32.26 U2.1 U2.2 U2.3
N$7
  Top 0.254: U2.10 46.8,37.19 46.44,37.55 46.44,37.68 46.44,39.83 45.68,40.6 | 45.76,40.51 45.68,40.6 | 45.68,40.6 R7.1
N$8
  Top 0.254: 10.16,8.89 9.06,9.99 D10.A
  Top 0.305: U3.1 8.57,7.72 9.74,8.89 10.16,8.89 13.18,8.89 13.97,8.1 L4.2
N$9
  Top 0.254: Q2.3 48.39,41.79 47.33,40.73 R7.2
N$10
  Top 0.254: R8.1 11.21,27.47 S6.3
N$11
  Top 0.254: U4.1 37.62,19.52 38.65,20.55 38.89,20.8 | 38.89,20.8 38.96,20.87 | 38.89,20.8 38.96,20.87 | 38.96,20.87 D5.A | L5.2 39.71,19.98 38.89,20.8
N$12
  Top 0.254: U5.1 50.94,19.57 51.82,20.45 | L6.2 52.1,20.16 51.82,20.45 | D6.A 52.11,20.74 51.82,20.45
N$13
  Top 0.15: 14.63,60.24 14.63,62.24 4.38,62.24 4.38,60.24 14.63,60.24
N$15
  Top 0.254: U6.4 22.12,39.05 C9.2
N$16
  Top 0.254: C27.1 88.65,81.79 | 88.65,81.79 R16.1 | R17.2 88.65,83.78 88.65,81.79
N$17
  Top 0.254: C26.2 R13.1
N$18
  Top 0.254: R31.2 33.88,66.17 S2.1
N$19
  Top 0.254: R30.2 S1.1
N$20
  Top 0.254: S3.1 13.89,66.05 R20.2
N$21
  Top 0.254: U7.6 51.1,68.61 48.89,66.4 RN1.8 48.95,66.35
N$22
  Top 0.254: U7.15 57.05,75.31 58.06,74.3 RN3.1
N$23
  Top 0.254: U7.7 51.74,68.12 50.16,66.55 RN1.7
N$24  (via drill 0.35)
  Top 0.254: U6.13 12.86,39.05 12.68,39.22 7.01,39.22 6.1,40.13 6.1,41.4
  other vias: 7.37,46.99 6.1,46.99 6.1,48.26 6.1,49.53 6.1,50.8
  pour Top (no thermals): 8.76,41.02 5.08,41.02 5.08,52.07 8.76,52.07
N$25
  Top 0.254: R45.2 16.68,49.7 16.51,49.53
  pour Top (no thermals): 15.24,42.42 19.18,42.42 19.18,50.93 13.34,50.93 13.34,47.12 15.11,47.12 15.24,46.99
N$26
  Top 0.254: U7.16 55.65,76.23 55.88,76.45 56.77,76.45 57.66,75.56 RN4.4
N$27
  Top 0.254: U7.8 52.4,67.89 51.43,66.93 RN1.6
N$28
  Top 0.254: U6.16 13.3,36.3 R21.1 R18.2
N$29
  Top 0.254: U7.17 54.99,76.71 55.24,76.96 57.28,76.96 58.49,76.96 RN4.3
N$30
  Top 0.254: R18.1 16.6,35.69 19.56,35.69 20.2,36.32 U6.1 U6.2 U6.3
N$31
  Top 0.254: R22.1 12.7,43.47 12.7,41.4 13.11,40.99 U6.10
N$32
  Top 0.254: R22.2 14.83,45.35 Q1.3
N$34
  Top 0.254: U7.9 53.03,67.23 52.7,66.9 RN1.5
N$35
  Top 0.254: U7.10 53.7,67.26 53.98,66.98 RN2.8
N$36
  Top 0.254: U7.11 54.36,67.56 55.24,66.67 RN2.7
N$37
  Top 0.254: U7.12 54.99,68.2 56.52,66.67 RN2.6
N$38
  Top 0.254: U7.13 55.65,68.79 55.99,68.45 56.01,68.45 57.78,66.67 RN2.5
N$39
  Top 0.254: U7.18 54.36,76.71 55.75,78.11 RN4.2
N$40
  Top 0.254: RN4.1 56.26,79.38 53.7,76.81 U7.19
N$41
  Top 0.254: U7.20 53.03,74.6 53.72,73.91 57.02,73.91 57.91,73.03 RN3.2
N$42
  Top 0.254: Q3.3 5.38,17.36 4.7,18.03 R12.1
N$43
  Top 0.254: Q4.3 4.8,22.29 C25.2 R12.2 4.9,20.79 6.6,19.09 R14.1
N$44
  Top 0.254: U7.21 52.45,75.26 52.45,74.59 53.76,73.28 56.52,73.28 58.04,71.76 RN3.3
N$45
  Top 0.254: U7.22 51.74,74.62 53.75,72.62 55.8,72.62 57.93,70.48 RN3.4
N$46
  Top 0.254: Q5.3 13.21,22.18 D13.A 13.17,23.88 R32.1
N$47
  Top 0.254: U8.56 78.87,74.42 77.98,73.53 C41.+
N$48
  Top 0.254: U9.4 89.94,44.77 R53.1 89.92,44.36 R52.2
N$49
  Top 0.254: Q6.3 37.05,9.14 D7.A 37.05,12.46 R54.1
N$50
  Top 0.254: Q7.3 43.72,9.98 D8.A R55.1
N$52
  Top 0.254: U9.2 83.23,45.72 L7.1 84.5,48.39 C42.2
N$53
  Top 0.254: C42.1 87.51,48.34 U9.6
N$54
  Top 0.254: R56.1 85.26,40.77 83.86,40.77 83.82,40.81 D9.A 83.64,40.76 Q8.3
N$55
  Top 0.254: 85.09,43.14 D9.C 83.74,43.06 Q8.4 | 85.09,43.14 85.3,43.14 C43.2 | 85.09,43.14 85.21,43.26 U9.3 86.05,44.77 87,45.72 U9.5
N$56
  Top 0.254: D12.A 69.22,14.39 69.22,12.19 | L8.2 72.31,12.19 69.22,12.19 | 69.22,12.19 68.58,12.19 68.2,12.19 67.5,11.49 U11.1
N$57
  Top 0.254: L9.2 85.85,11.86 82.5,11.86 82.34,12.02 82.34,13.46 | 82.34,13.46 D14.A | U12.1 81.09,10.8 82.36,12.07 82.36,13.44 82.34,13.46
N$58
  Top 0.254: D15.A 68.08,31.82 67.34,31.08 | 67.34,31.08 66.55,30.3 65.72,29.46 U13.1 | L10.2 69.04,29.39 67.34,31.08
N$59
  Top 0.254: U14.1 81.59,29.51 82,29.92 83.27,29.92 | 83.27,29.92 86.33,29.92 L11.2 | 83.27,29.92 83.27,30.9 D16.A
N$60
  Top 0.254: Q9.3 70.09,3.73 D17.A 71.88,3.98 R41.1
N$61
  Top 0.254: Q10.3 82.41,3.85 D18.A 85.86,3.85 R42.1
N$62
  Top 0.152: Q11.3 69.58,21.51 D19.A 71.24,21.63 R43.1
N$63
  Top 0.254: Q12.3 85.45,21.38 D20.A 87.25,21.63 R44.1
N$65
  Top 0.254: R45.1 C58.2
N$67
  Top 0.254: Q3.1 5.16,15.16 2.54,17.78 2.54,25.91 5.08,28.45 9.53,28.45 11.05,29.97 S6.2
OE
  Top 0.254: U8.46 71.04,80.18 69.22,78.36 66.04,78.36 64.14,80.26 54.86,80.26 51.1,76.51 U7.23
OVP/PWM_TAIL_MID
  Top 0.254: U2.15 46.51,33.94 45.59,33.02 43.16,33.02 42.77,32.64 T3.1
P1  (via drill 0.35)
  Top 0.254: v43.31,82.68 43.31,78.87 37.85,73.41 25.62,73.41 R24.2 C34.1 18.84,77.9 X1.P$5 | U8.31 75.87,89.47 75.68,89.66 v72.9,89.66
  Bottom 0.254: v43.31,82.68 41.91,84.07 41.91,95.32 45.04,98.45 64.11,98.45 v72.9,89.66
P2  (via drill 0.35)
  Top 0.254: v77.34,86.49 77.34,88.57 U8.28 | v44.2,81.41 44.2,74.04 42.86,72.71 | 42.86,72.71 42.67,72.52 | X1.P$1 5.18,76.64 C33.1 R27.2 7.15,76.03 8,75.18 8,73.66 | 8,73.28 8,73.66 | 8,73.66 8,72.01 9.53,70.48 15.88,70.48 17.78,68.58 29.21,68.58 33.02,72.39 42.55,72.39 42.86,72.71
  Bottom 0.254: v44.2,81.41 44.32,81.53 44.32,96.39 45.72,97.79 63.5,97.79 72.77,88.52 73.91,88.52 76.45,85.98 76.83,85.98 v77.34,86.49
P3  (via drill 0.35)
  Top 0.254: U8.29 76.87,89.75 73.91,92.71 73.05,92.71 v72.9,92.56 | R25.2 C35.1 15.24,77.84 X1.P$4 17.29,80.01 21.59,80.01 26.67,74.93 v37.34,74.93
  Bottom 0.254: v72.9,92.56 65.64,99.82 43.94,99.82 39.37,95.25 39.37,76.2 38.1,74.93 v37.34,74.93
P4  (via drill 0.35)
  Top 0.254: U8.30 76.37,89.68 74.36,91.69 72.26,91.69 71.37,92.58 v71.37,92.56 | X1.P$2 10.18,76.36 9.86,76.03 C36.1 R26.2 13.34,74.26 13.34,72.39 14.2,71.53 16.68,71.53 18.99,69.22 29.27,69.22 32.85,72.8 39.14,72.8 v40.39,74.04
  Bottom 0.254: v71.37,92.56 64.75,99.19 44.58,99.19 40.64,95.25 40.64,74.3 v40.39,74.04
PGC
  Top 0.254: U8.14 86.68,85.68 87.68,86.68 90.17,86.68 91.44,85.41 91.44,78.74 88.9,76.2 86.36,76.2 82.7,72.54 X2.P$3
PGD  (via drill 0.35)
  Top 0.254: U8.13 87.34,85.18 88.01,85.85 v88.9,85.85 | X2.P$2 v84.7,68.44 v84.71,68.45
  Bottom 0.254: v88.9,85.85 90.68,85.85 91.44,85.09 91.44,77.47 84.71,70.74 v84.71,68.45
PWM_CHMSL
  Top 0.254: U14.4 76.33,26.41 75.56,27.18 75.56,42.54 75.56,57.78 72.39,60.96 57.15,60.96 56.52,61.59 RN2.3
PWM_LET
  Top 0.254: U13.4 60.46,26.54 59.05,27.94 59.05,32.77 73.66,47.37 73.66,57.15 71.12,59.69 56.77,59.69 55.24,61.21 RN2.2
PWM_T/B_LOW  (via drill 0.35)
  Top 0.254: RN1.2 50.16,63.5 50.16,62.86 49.53,62.23 v46.99,62.23
  Bottom 0.254: S7.21 29.62,4.29 32.13,6.8 32.13,22.73 25.53,29.34 25.53,35.69 31.75,41.91 31.75,60.96 33.02,62.23 v46.99,62.23
PWM_T/B_UPP  (via drill 0.35)
  Top 0.254: v45.72,63.5 46.43,64.21 RN1.1
  Bottom 0.254: 27.5,40.2 18.29,30.99 18.29,8.06 22.06,4.29 S7.11 | 27.5,40.2 28.32,41.02 | 27.5,40.2 30.48,43.18 30.48,53.97 29.21,55.24 29.21,60.96 31.75,63.5 v45.72,63.5
PWM_TAIL_LOW  (via drill 0.35)
  Top 0.254: U5.4 48.26,16.38 v47.12,16.38 | v53.85,59.82 53.98,59.94 RN2.1
  Bottom 0.254: v47.12,16.38 45.85,17.65 45.85,26.42 44.32,27.94 30.48,27.94 29.21,29.21 29.21,31.75 31.75,34.29 35.94,34.29 38.48,36.83 38.48,49.02 49.28,59.82 v53.85,59.82
PWM_TAIL_MID
  Top 0.254: R15.2 47.12,29.55 47.12,28.83 46.23,27.94 44.35,27.94 T3.3 38.48,33.81 38.48,49.02 45.72,56.26 45.72,58.42 47.12,59.82 51.69,59.82 52.7,60.83 RN1.4
PWM_TAIL_UPP
  Top 0.254: U4.4 33.5,17.05 32.13,18.41 32.13,22.73 25.53,29.34 25.53,35.69 31.75,41.91 31.75,59.69 33.02,60.96 50.8,60.96 51.43,61.59 51.43,62.23 RN1.3
PWM_TI
  Top 0.254: U8.49 74.31,76.2 69.85,76.2 58.93,65.28 58.93,65.29 43.45,65.29 42.3,64.14 41.27,64.14 32.38,64.14 29.21,60.96 29.21,55.24 30.48,53.97 30.48,43.18 20.32,33.02 10.16,33.02 8.64,31.5 S6.1
RESET  (via drill 0.35)
  Top 0.254: S2.3 33.74,70.83 C28.1 36.62,71.12 v37.97,71.12 | v37.97,92.71 38.1,92.71 43.81,98.43 76.45,98.43 77.98,98.43 80.37,96.03 U8.22
  Bottom 0.254: v37.97,92.71 32,92.71 29.34,90.04 29.34,77.22 35.43,71.12 v37.97,71.12
REV
  Top 0.305: JP2.5 49.53,4.95 50.8,6.22 59.94,6.22 64.39,1.78 77.98,1.78 80.01,3.81
  pour Top (no thermals): 81.8,6.81 81.8,2.22 78.25,2.22 78.25,6.81
REV_A  (via drill 0.35)
  Route15 0.508: JP5.6 64.77,53.34 67.31,50.8 67.31,46.61 75.56,38.35 75.56,21.46 78.99,18.03 79.25,17.78 v84.58,17.78
  other vias: 83.95,17.78 85.22,17.78 85.85,17.14 85.85,16.51 85.85,15.88 85.85,17.78
  pour Top (rank 3, no thermals): 83.52,18.67 83.52,13.42 86.62,13.42 86.62,18.67
  pour Top (rank 2, no thermals): 83.52,18.67 83.52,13.42 86.62,13.42 86.62,18.67
  pour Route15 (rank 2, no thermals): 83.52,18.67 83.52,13.42 86.62,13.42 86.62,18.67
REV_K  (via drill 0.35)
  Route15 0.508: v77.14,13.97 77.14,15.57 74.3,18.41 74.3,36.96 66.04,45.21 66.04,50.29 62.74,53.59 62.23,54.1 JP5.5
  other vias: 77.78,13.97 78.41,13.97 79.05,13.97 77.14,13.33 77.14,12.7 77.14,12.06
  pour Top (rank 3, no thermals): 76.3,9.36 79.73,9.36 79.73,14.7 76.3,14.7
  pour Route15 (rank 2, no thermals): 76.3,9.36 79.73,9.36 79.73,14.7 76.3,14.7
ROT_+
  Top 0.254: R28.2 25.27,79.41 C37.1 27.81,81.23 X3.P$1 27.98,81.24 30.9,78.32 32.8,76.42 | 35.46,76.42 32.8,76.42 | U8.27 77.87,89.49 77.16,90.21 77.16,90.23 72.77,94.62 70.99,94.62 68.58,97.03 44.96,97.03 41.91,93.98 41.91,82.87 35.46,76.42 | 35.46,76.42 32.8,76.42
ROT_-
  Top 0.254: U8.24 79.37,89.53 79.76,89.92 79.76,93.73 75.69,97.79 44.45,97.79 40.64,93.98 40.64,86.07 R29.2 35.66,81.4 X3.P$3 33.53,80.85 C38.1
SCL  (via drill 0.35)
  Top 0.254: U8.37 72.63,84.68 71.73,85.58 71.73,86.23 71.06,86.91 67.31,86.91 R34.2 66.17,86.91 64.56,85.3 | U7.26 49.15,76.33 49.91,77.09 50.93,77.09 54.61,80.77 60.03,80.77 64.56,85.3 | U10.6 50.8,87.76 52.2,89.15 57.15,89.15 57.28,89.15 | v58.55,89.15 57.28,89.15 | JP1.3 56.64,89.79 57.28,89.15 | v61.98,85.73 64.14,85.73 64.56,85.3
  Bottom 0.254: v58.55,89.15 v61.98,85.73
SDA
  Top 0.254: U8.36 72.7,85.18 72.26,85.62 72.26,86.49 70.95,87.8 66.04,87.8 64.77,87.8 R33.2 62.23,87.8 | 58.29,87.8 58.42,87.8 | 58.42,87.8 60.71,87.8 62.23,87.8 | U10.5 52.07,87.38 52.49,87.8 52.7,87.8 | 52.7,87.8 58.42,87.8 | U7.27 48.49,77.06 50.16,78.74 51.94,78.74 54.48,81.28 54.48,86.02 52.7,87.8 | JP1.4 60.71,92.08 60.71,89.32 62.23,87.8
T/B
  Top 0.254: 38.35,7.75 38.23,7.62
  Top 0.305: JP2.2 41.91,3.94 40.89,4.95 38.35,7.75
  pour Top (rank 2, no thermals): 33.83,8.65 38.8,8.65 38.8,5.1 33.83,5.1
T/B_LOW_OUT_A  (via drill 0.35)
  Route2 0.508: v26.92,25.78 26.92,34.54 31.75,39.37 31.75,52.07 30.48,53.34 JP3.6
  other vias: 25.02,25.78 25.65,25.78 26.29,25.78 26.92,25.15 26.92,24.51 26.92,23.88
  pour Top (rank 3, no thermals): 24.47,26.29 24.47,20.79 27.57,20.79 27.57,26.29
T/B_LOW_OUT_K  (via drill 0.35)
  Route15 0.508: JP3.5 27.94,53.34 30.35,50.93 30.35,39.24 20.32,29.21 20.32,22.28 v20.37,22.22
  other vias: 19.74,22.22 21.01,22.22 19.1,22.22 19.1,21.59 19.1,20.95 19.1,20.32
  pour Top (rank 2, no thermals): 18.34,17.82 21.56,17.82 21.56,23.15 18.34,23.15
  pour Route15 (rank 2, no thermals): 18.34,17.82 21.56,17.82 21.56,23.15 18.34,23.15
T/B_UPP_OUT_A  (via drill 0.35)
  Top 0.152: 11.26,12.8 D10.C
  Route2 0.508: v12.7,14.61 14.48,14.61 16.13,16.26 16.13,28.83 30.48,43.18 30.48,50.8 27.94,53.34 24.26,53.34 22.86,54.74 JP3.3
  other vias: 10.79,14.61 11.43,14.61 12.07,14.61 12.7,13.97 12.7,13.34 12.7,12.7
  pour Top (rank 3, no thermals): 10.16,15.28 10.16,9.39 13.26,9.39 13.26,15.28
T/B_UPP_OUT_K  (via drill 0.35)
  Top 0.152: U3.3 6.01,8.16 R19.1
  Route2 0.508: v4.62,10.54 4.62,14.43 3.43,15.62 3.43,55.5 5.08,57.15 JP3.1
  other vias: 5.26,10.54 5.89,10.54 6.53,10.54 4.62,9.91 4.62,9.27 4.62,8.63
  pour Top (rank 2, no thermals): 3.56,6.48 7.11,6.48 7.11,11.81 3.56,11.81
TAIL
  Top 0.305: JP2.3 44.45,4.45 41.53,7.37 41.53,8.89
  pour Top (rank 2, no thermals): 43.07,13.67 43.07,8.07 39.52,8.07 39.52,13.67
TAIL_LOW_A  (via drill 0.35)
  Route2 0.508: 53.59,25.91 52.32,27.18 44.83,27.18 37.34,34.67 37.34,50.67 40.64,53.97 JP3.10
  other vias: 54.23,25.91 54.86,25.91 55.5,25.27 55.5,24.64 55.5,24 55.5,25.91
  pour Top (rank 3, no thermals): 53.05,26.55 53.05,21.3 56.14,21.3 56.14,26.55
  pour Route2 (rank 3, no thermals): 53.05,26.55 53.05,21.3 56.14,21.3 56.14,26.55
TAIL_LOW_K  (via drill 0.35)
  Route15 0.508: v46.66,22.86 35.81,33.71 35.81,52.32 38.1,54.61 JP3.9
  other vias: 47.3,22.86 47.93,22.86 48.57,22.86 46.66,22.22 46.66,21.59 46.66,20.95
  pour Top (rank 2, no thermals): 45.95,18.13 49.63,18.13 49.63,23.59 45.95,23.59
  pour Route15 (rank 2, no thermals): 45.95,18.13 49.63,18.13 49.63,23.59 45.95,23.59
TAIL_MID_A  (via drill 0.35)
  Route2 0.508: v57.78,46.99 55.24,49.53 45.72,49.53 43.18,52.07 JP3.11
  other vias: 59.05,46.99 59.05,45.72 59.05,44.45 57.78,44.45 57.78,45.72
  pour Top (rank 2, no thermals): 52.96,40.77 62.48,40.77 62.48,47.62 52.96,47.62
  pour Route2 (rank 2, no thermals): 52.96,40.77 62.48,40.77 62.48,47.62 52.96,47.62
TAIL_UPP_A  (via drill 0.35)
  Route2 0.508: v40.39,25.27 40.39,29.08 34.29,35.18 34.29,53.34 35.56,54.61 JP3.8
  other vias: 41.02,25.27 41.66,25.27 42.29,24.64 42.29,24 42.29,23.37 42.29,25.27
  pour Top (rank 3, no thermals): 39.96,26.42 39.96,21.17 43.06,21.17 43.06,26.42
  pour Route2 (rank 3, no thermals): 39.96,26.42 39.96,21.17 43.06,21.17 43.06,26.42
TAIL_UPP_K  (via drill 0.35)
  Route2 0.508: v33.58,22.48 33.58,25.02 29.21,29.39 29.21,34.29 33.02,38.1 JP3.7
  other vias: 34.22,22.48 34.85,22.48 35.49,22.48 33.58,21.84 33.58,21.21 33.58,20.57
  pour Top (rank 2, no thermals): 32.49,18.25 36.04,18.25 36.04,23.46 32.49,23.46
  pour Route2 (rank 2, no thermals): 32.49,18.25 36.04,18.25 36.04,23.46 32.49,23.46
TI  (via drill 0.35)
  Bottom 0.305: v13.34,17.14 17.02,13.46 17.02,5.74 21.59,1.17 38,1.17 JP2.1
  other vias: 12.07,17.14 10.79,17.14
  pour Top (rank 2, no thermals): 9.07,20.08 14.67,20.08 14.67,16.53 9.07,16.53
  pour Route2 (rank 2, no thermals): 9.07,20.08 14.67,20.08 14.67,16.53 9.07,16.53
TI_A  (via drill 0.35)
  Route2 0.508: v23.49,50.29 20.32,53.47 JP3.2
  other vias: 24.77,50.29 24.77,49.02 24.77,47.75 23.49,47.75 23.49,49.02
  pour Top (rank 2, no thermals): 19.3,44.58 28.83,44.58 28.83,51.43 19.3,51.43
  pour Route2 (rank 2, no thermals): 19.3,44.58 28.83,44.58 28.83,51.43 19.3,51.43
V_CHMSL
  pour Top (rank 2, no thermals): 78.61,27.43 89.92,27.43 89.92,22.86 78.61,22.86
V_FOG
  pour Top (rank 2, no thermals): 64.52,9.65 75.82,9.65 75.82,5.46 64.52,5.46
V_LET
  pour Top (rank 2, no thermals): 62.99,27.56 74.3,27.56 74.3,22.86 62.99,22.86
V_REV
  pour Top (rank 2, no thermals): 77.98,9.27 89.28,9.27 89.28,5.21 77.98,5.21
V_T/B  (via drill 0.35)
  Top 0.152: 9.98,5.2 10.13,5.05 C12.1 10.53,4.65 L4.1
  Top 0.254: L1.1 33.52,10.68 D7.C
  Route2 0.254: v14.99,3.05 16.71,3.05 21.05,7.39 S7.10 22.7,8.61 23.37,9.27 26.16,9.27 26.23,9.21 | 26.23,9.21 26.61,8.83 26.83,8.61 S7.20 | 26.23,9.21 27.81,10.79 v27.81,14.48
  pour Top (no thermals): 4.83,6.35 17.78,6.35 17.78,2.54 4.83,2.54
  pour Top (no thermals): 16.64,17.79 32.13,17.79 32.13,13.98 16.64,13.98
  pour Top (no thermals): 32.95,8.7 35.95,8.7 35.95,11.6 32.95,11.6
V_TAIL  (via drill 0.35)
  Top 0.254: Q7.4 43.62,14.41 44.45,15.24 43.11,16.58 L5.1
  Route15 0.305: S4.3 31.12,22.61 32,21.72 32,17.27 v33.66,15.62
  pour Top (no thermals): 61.95,18.2 32.45,18.2 32.45,14.15 61.95,14.15
  pour Top (no thermals): 61.95,18.2 32.45,18.2 32.45,14.15 61.95,14.15
  pour Top (no thermals): 43.12,14.04 43.12,11.04 46.02,11.04 46.02,14.04
  pour Top (no thermals): 61.95,18.2 32.45,18.2 32.45,14.15 61.95,14.15
  pour Route15 (rank 2, no thermals): 40.48,18.2 32.45,18.2 32.45,14.15 40.48,14.15
V_TAIL1  (via drill 0.35)
  Bottom 0.305: S4.2 39.37,36.58 44.7,36.58 45.34,37.21 v45.34,37.59
  other vias: 45.34,38.86 45.34,38.23
  pour Top (rank 2, no thermals): 48.64,35.56 40.64,35.56 40.64,37.08 42.67,37.08 42.67,42.29 44.83,42.29 44.83,39.24 46.74,39.24 46.74,36.83 48.64,36.83
V_TI  (via drill 0.35)
  Top 0.254: R8.2 14.1,26.54 v14.73,25.91
  Route2 0.254: v14.73,25.91 14.73,22.61 13.08,20.96 v9.91,20.96
  other vias: 8.64,20.96
  pour Top (no thermals): 6.4,20.13 12.2,20.13 12.2,22.65 6.4,22.65
  pour Route2 (no thermals): 6.4,20.13 12.2,20.13 12.2,22.65 6.4,22.65
V_TI_BOOST  (via drill 0.35)
  Route2 0.254: v11.3,41.27 10.29,40.26
  Route2 0.305: v5.08,25.4 5.08,39.37 5.97,40.26 6.6,40.26
  other vias: 11.3,42.54 11.3,41.91 6.35,25.4 7.62,25.4
  pour Top (rank 2, no thermals): 15.11,39.37 6.1,39.37 6.1,40.89 8.89,40.89 8.89,46.1 10.29,46.1 10.29,43.05 13.08,43.05 13.08,40.64 15.11,40.64
  pour Top (rank 2, no thermals): 3.74,22.92 9.79,22.92 9.79,25.95 3.74,25.95
  pour Route2 (rank 2, no thermals): 3.74,22.92 9.79,22.92 9.79,25.95 3.74,25.95
  pour Route2 (rank 2, no thermals): 15.11,39.37 6.1,39.37 6.1,40.89 8.89,40.89 8.89,46.1 10.29,46.1 10.29,43.05 13.08,43.05 13.08,40.64 15.11,40.64
VCC  (via drill 0.35)
  Route2 0.305: JP2.8 57.91,1.78 88.14,1.78 91.44,5.08 91.44,35.56 88.9,38.1 81.28,38.1 79.88,39.5 v79.88,39.88
  pour Top (rank 2, no thermals): 81.79,43.81 81.79,39.37 78.74,39.37 78.74,43.81
  pour Route2 (rank 2, no thermals): 81.79,43.81 81.79,39.37 78.74,39.37 78.74,43.81

## Text on the board
Top: SKCSMI-2023
tNames: 1379 ECU | Rev. 1.0